# EAGLE design rangerBoard (EAGLE 9.6.1)
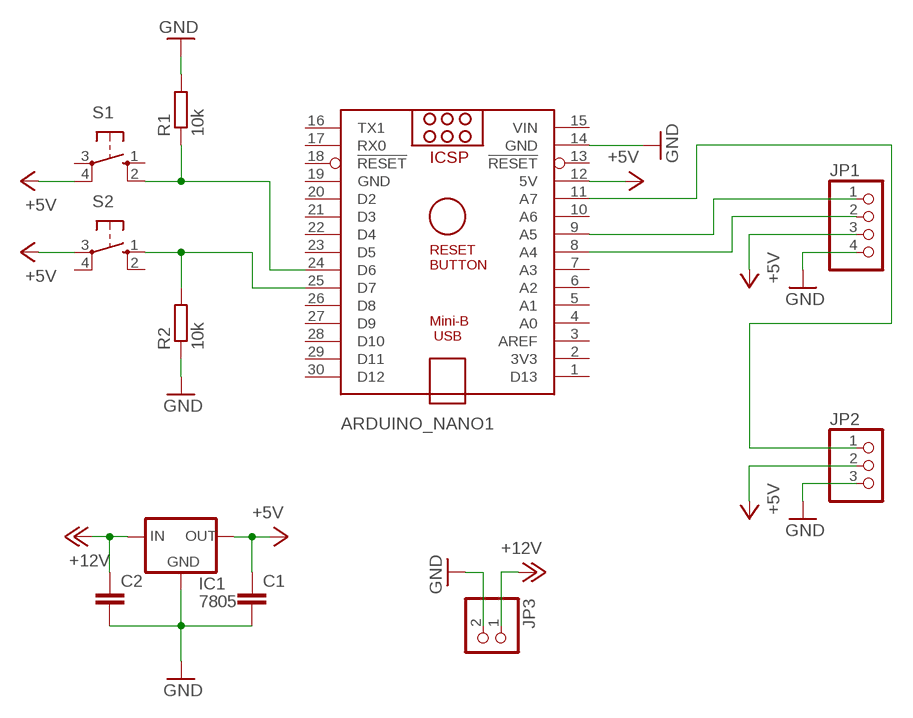
[diagram p0: schematic, sheet 1]

## Parts
ARDUINO_NANO1  ARDUINO_NANO  [ARDUINO_NANO]
C1  C5/7.2  [C5B7.2]
C2  C5/7.2  [C5B7.2]
IC1  7805  78XXL  [78XXL]
JP1  PINHD-1X4  [1X04]
JP2  PINHD-1X3  [1X03]
JP3  PINHD-1X2  [1X02]
R1  10k  R-EU_0204/7  [0204/7]
R2  10k  R-EU_0204/7  [0204/7]
S1  10-XX  [B3F-10XX]
S2  10-XX  [B3F-10XX]

## Nets
+5V: ARDUINO_NANO1.12(5V) C1.1 IC1.OUT JP1.3 JP2.2 S1.4(P1) S2.3(P)
+12V: C2.1 IC1.IN JP3.1
GND: ARDUINO_NANO1.14(GND) C1.2 C2.2 IC1.GND JP1.4 JP2.3 JP3.2 R1.2 R2.1
N$1: ARDUINO_NANO1.24(D6) R1.1 S1.2(S1)
N$2: ARDUINO_NANO1.25(D7) R2.2 S2.1(S)
N$3: ARDUINO_NANO1.11(A7) JP2.1
N$4: ARDUINO_NANO1.8(A4) JP1.2
N$5: ARDUINO_NANO1.9(A5) JP1.1
Unconnected: ARDUINO_NANO1.1(D13) ARDUINO_NANO1.2(3V3) ARDUINO_NANO1.3(AREF) ARDUINO_NANO1.4(A0) ARDUINO_NANO1.5(A1) ARDUINO_NANO1.6(A2) ARDUINO_NANO1.7(A3) ARDUINO_NANO1.10(A6) ARDUINO_NANO1.13(!RESET) ARDUINO_NANO1.16(TX1) ARDUINO_NANO1.17(RX0) ARDUINO_NANO1.18(!RESET) ARDUINO_NANO1.20(D2) ARDUINO_NANO1.21(D3) ARDUINO_NANO1.22(D4) ARDUINO_NANO1.23(D5) ARDUINO_NANO1.26(D8) ARDUINO_NANO1.27(D9) ARDUINO_NANO1.28(D10) ARDUINO_NANO1.29(D11) ARDUINO_NANO1.30(D12) S1.1(S) S1.3(P) S2.2(S1) S2.4(P1)

## Power pins joined to a net without a drawn wire
GND: ARDUINO_NANO1.19(GND)
VIN: ARDUINO_NANO1.15(VIN)

## Library data of the parts
ARDUINO_NANO1 = ArduinoNanoV30:ARDUINO_NANO: Arduino Nano V3.0 Overview: The Arduino Nano is a small, complete, and breadboard-friendly board based on the ATmega328 (Arduino Nano 3.x) or ATmega168 (Arduino Nano 2.x). It has more or less the same functionality of the Arduino Duemilanove, but in a different package. It lacks only a DC power jack, and works with a Mini-B USB cable instead of a standard one. The Nano was designed and is being produced by Gravitech. Specifications: Microcontroller Atmel ATmega168 or ATmega328 Operating Voltage (logic level) 5 V Input Voltage (recommended) 7-12 V Input Voltage (limits) 6-20 V Digital I/O Pins 14 (of which 6 provide PWM output) Analog Input Pins 8 DC Current per I/O Pin 40 mA Flash Memory 16 KB (ATmega168) or 32 KB (ATmega328) of which 2 KB used by bootloader SRAM 1 KB (ATmega168) or 2 KB (ATmega328) EEPROM 512 bytes (ATmega168) or 1 KB (ATmega328) Clock Speed 16 MHz Dimensions 0.73" x 1.70" Length 45 mm Width 18 mm Weigth 5 g Power: The Arduino Nano can be powered via the Mini-B USB connection, 6-20V unregulated external power supply (pin 30), or 5V regulated external power supply (pin 27). The power source is automatically selected to the highest voltage source. Memory: The ATmega168 has 16 KB of flash memory for storing code (of which 2 KB is used for the bootloader); the ATmega328 has 32 KB, (also with 2 KB used for the bootloader). The ATmega168 has 1 KB of SRAM and 512 bytes of EEPROM (which can be read and written with the EEPROM library); the ATmega328 has 2 KB of SRAM and 1 KB of EEPROM. Input and Output: Each of the 14 digital pins on the Nano can be used as an input or output, using pinMode(), digitalWrite(), and digitalRead() functions. They operate at 5 volts. Each pin can provide or receive a maximum of 40 mA and has an internal pull-up resistor (disconnected by default) of 20-50 kOhms. In addition, some pins have specialized functions. Visit Arduino - ArduinoBoardNano <https://www.arduino.cc/en/Main/ArduinoBoardNano>
C1 C2 = capacitor-wima:C: CAPACITOR naming: grid - package width
IC1 = v-reg:78XXL: VOLTAGE REGULATOR
JP1 = pinhead:PINHD-1X4: PIN HEADER
JP2 = pinhead:PINHD-1X3: PIN HEADER
JP3 = pinhead:PINHD-1X2: PIN HEADER
R1 R2 = rcl:R-EU_: RESISTOR, European symbol; SPICEPREFIX: R
S1 S2 = switch-omron:10-XX: OMRON SWITCH; MPN: B3F-1000; OC_FARNELL: 176432; OC_NEWARK: 36M3542

## Board
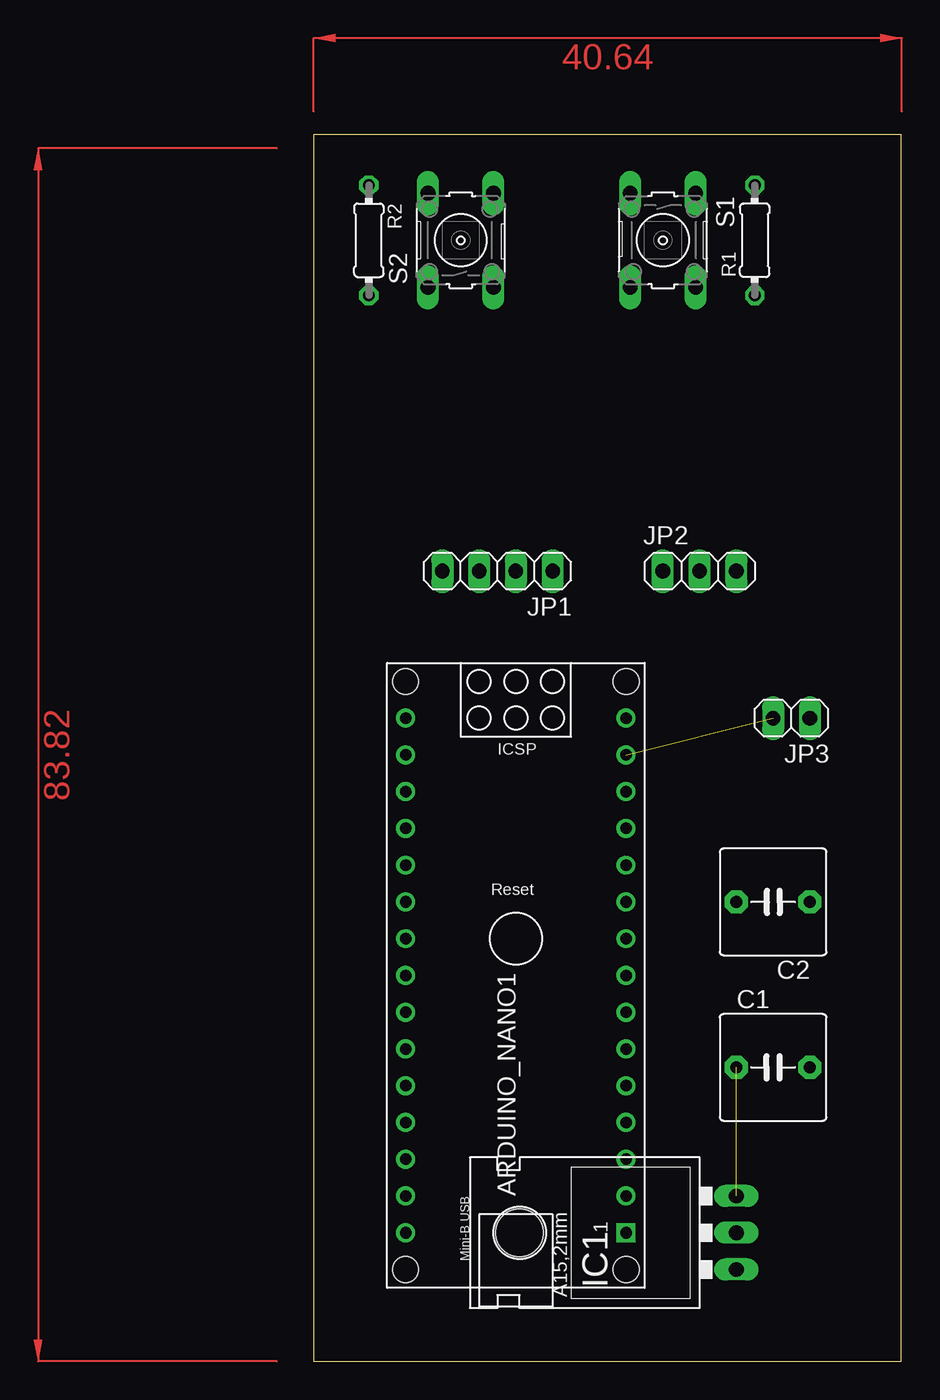
[diagram p1: board, top side]
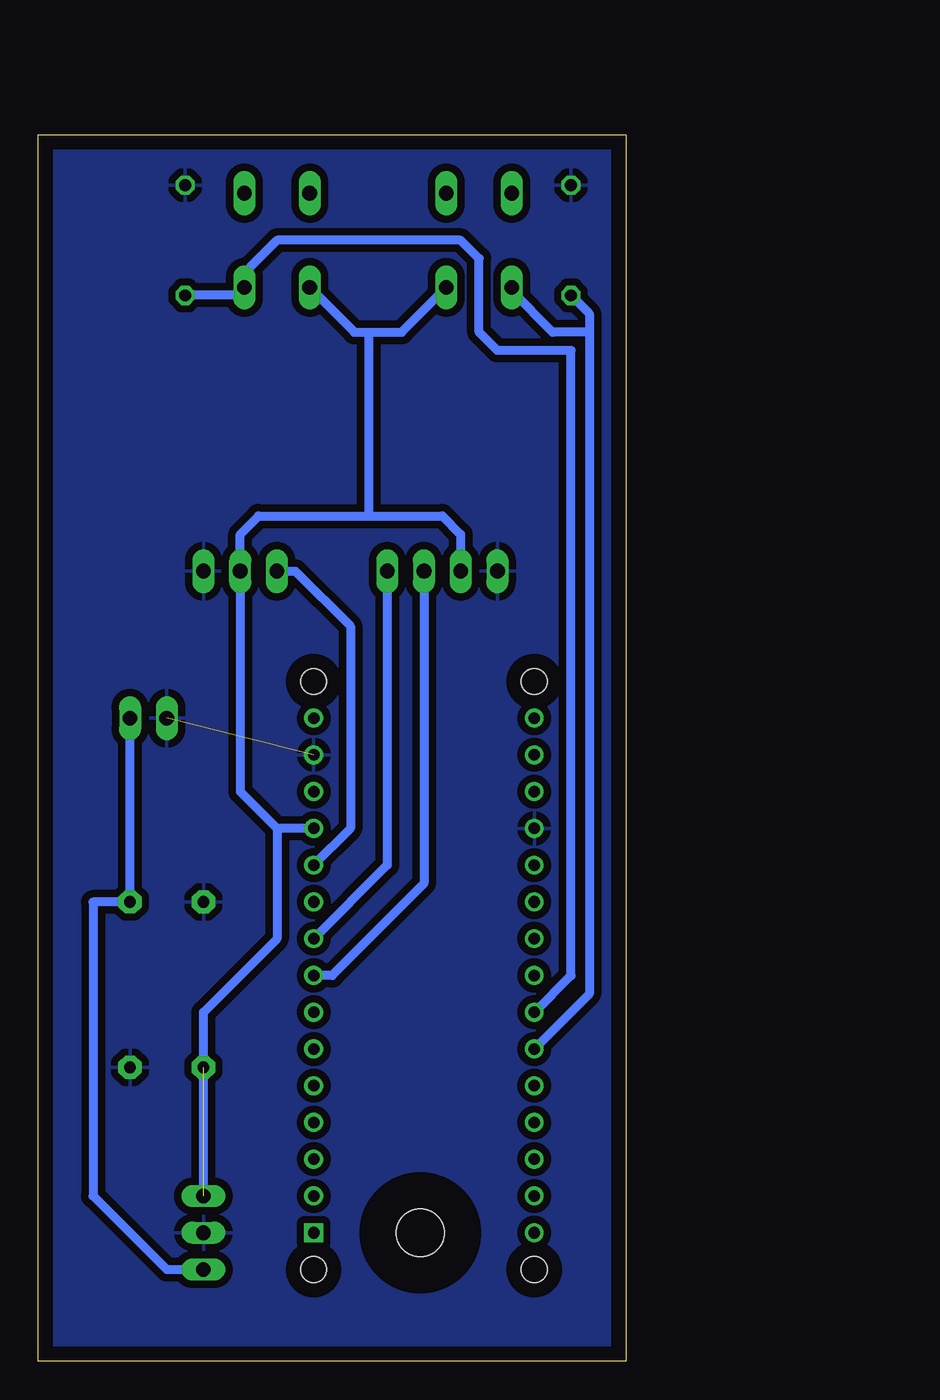
[diagram p2: board, bottom side, seen from below]

Size 40.62 x 84.76 mm. Coordinates in mm from the lower left corner, seen from the top.
Outline: 0,0 40.62,0 40.62,84.76 0,84.76 0,0
Copper layers (1*16): Top 0.035mm / dielectric 1.5mm / Bottom 0.035mm
Design rules "default2": minimum track width 25mil, minimum drill 0.35mm, track to track 20mil, track to pad 20mil, pad to pad 20mil, via to via 20mil, smd to smd 20mil, copper to edge 40mil, drill to drill 6mil, minimum pad ring 10mil, minimum via ring 8mil, stop-mask expansion 4mil, vias tented up to drill 0mil, thermal gap 20mil

### Footprints (pad centres in the part's own frame; a part is rotated, then mirrored left to right if it is on the bottom)
ARDUINO_NANO = drill 0.8 square: 1 -20.32,-7.62 | drill 0.8: 2 -17.78,-7.62; 3 -15.24,-7.62; 4 -12.7,-7.62; 5 -10.16,-7.62; 6 -7.62,-7.62; 7 -5.08,-7.62; 8 -2.54,-7.62; 9 0,-7.62; 10 2.54,-7.62; 11 5.08,-7.62; 12 7.62,-7.62; 13 10.16,-7.62; 14 12.7,-7.62; 15 15.24,-7.62; 16 15.24,7.62; 17 12.7,7.62; 18 10.16,7.62; 19 7.62,7.62; 20 5.08,7.62; 21 2.54,7.62; 22 0,7.62; 23 -2.54,7.62; 24 -5.08,7.62; 25 -7.62,7.62; 26 -10.16,7.62; 27 -12.7,7.62; 28 -15.24,7.62; 29 -17.78,7.62; 30 -20.32,7.62 | hole 1.778: -22.86,-7.62; -22.86,7.62; 17.78,7.62; 17.78,-7.62
C5B7.2 = drill 0.813 pad 1.6 octagon: 1 -2.54,0; 2 2.54,0
78XXL = drill 1.016 long: GND 0,-3.81; IN -2.54,-3.81; OUT 2.54,-3.81 | hole 3.302: 0,11.176
1X04 = drill 1.016 long: 1 -3.81,0; 2 -1.27,0; 3 1.27,0; 4 3.81,0
1X03 = drill 1.016 long: 1 -2.54,0; 2 0,0; 3 2.54,0
1X02 = drill 1.016 long: 1 -1.27,0; 2 1.27,0
0204/7 = drill 0.813 octagon: 1 -3.81,0; 2 3.81,0
B3F-10XX = drill 1.016 long: 1 -3.251,2.261; 2 3.251,2.261; 3 -3.251,-2.261; 4 3.251,-2.261

### Placement (x,y rotation side)
ARDUINO_NANO1  13.97,29.21 90 top
C1  31.75,20.32 0 top
C2  31.75,31.75 180 top
IC1  25.4,8.89 90 top
JP1  12.7,54.61 180 top
JP2  26.67,54.61 0 top
JP3  33.02,44.45 180 top
R1  30.48,77.47 90 top
R2  3.81,77.47 270 top
S1  24.13,77.47 270 top
S2  10.16,77.47 90 top

### Tracks (layer width: path | path; a pad name or v marks a point on that pad's centre or on a via)
+5V  (1 unrouted)
  Bottom 0.635: IC1.OUT 29.21,24.13 24.13,29.21 24.13,36.83 | S1.4 18.77,71.12 17.78,71.12 | S2.3 15.52,71.12 17.78,71.12 | 24.13,36.83 26.67,39.37 JP2.2 26.67,57.15 25.4,58.42 17.78,58.42 | ARDUINO_NANO1.12 24.13,36.83 | JP1.3 11.43,57.15 12.7,58.42 17.78,58.42 | 17.78,58.42 17.78,71.12
+12V
  Bottom 0.635: IC1.IN 31.75,6.35 36.83,11.43 36.83,31.75 C2.1 JP3.1
GND  (1 unrouted)
  pour Bottom: 0,100.33 0,0 44.45,0 44.45,100.33
N$1
  Bottom 0.635: ARDUINO_NANO1.24 3.81,26.67 3.81,69.85 8.89,69.85 10.16,71.12 10.16,76.2 11.43,77.47 24.13,77.47 26.39,75.21 S1.2 26.67,73.66 R1.1
N$2
  Bottom 0.635: ARDUINO_NANO1.25 2.54,25.4 2.54,71.12 | 2.54,71.12 2.54,72.39 R2.2 | 2.54,71.12 5.08,71.12 7.9,73.94 S2.1
N$3
  Bottom 0.635: ARDUINO_NANO1.11 19.05,36.83 19.05,50.8 22.86,54.61 JP2.1
N$4
  Bottom 0.635: ARDUINO_NANO1.8 20.32,26.67 13.97,33.02 JP1.2
N$5
  Bottom 0.635: ARDUINO_NANO1.9 16.51,34.29 JP1.1
(copper drawn outside any net)
  shapes: Top area x2